# EAGLE design WTPA2_Jack_PCB (EAGLE 5.10)
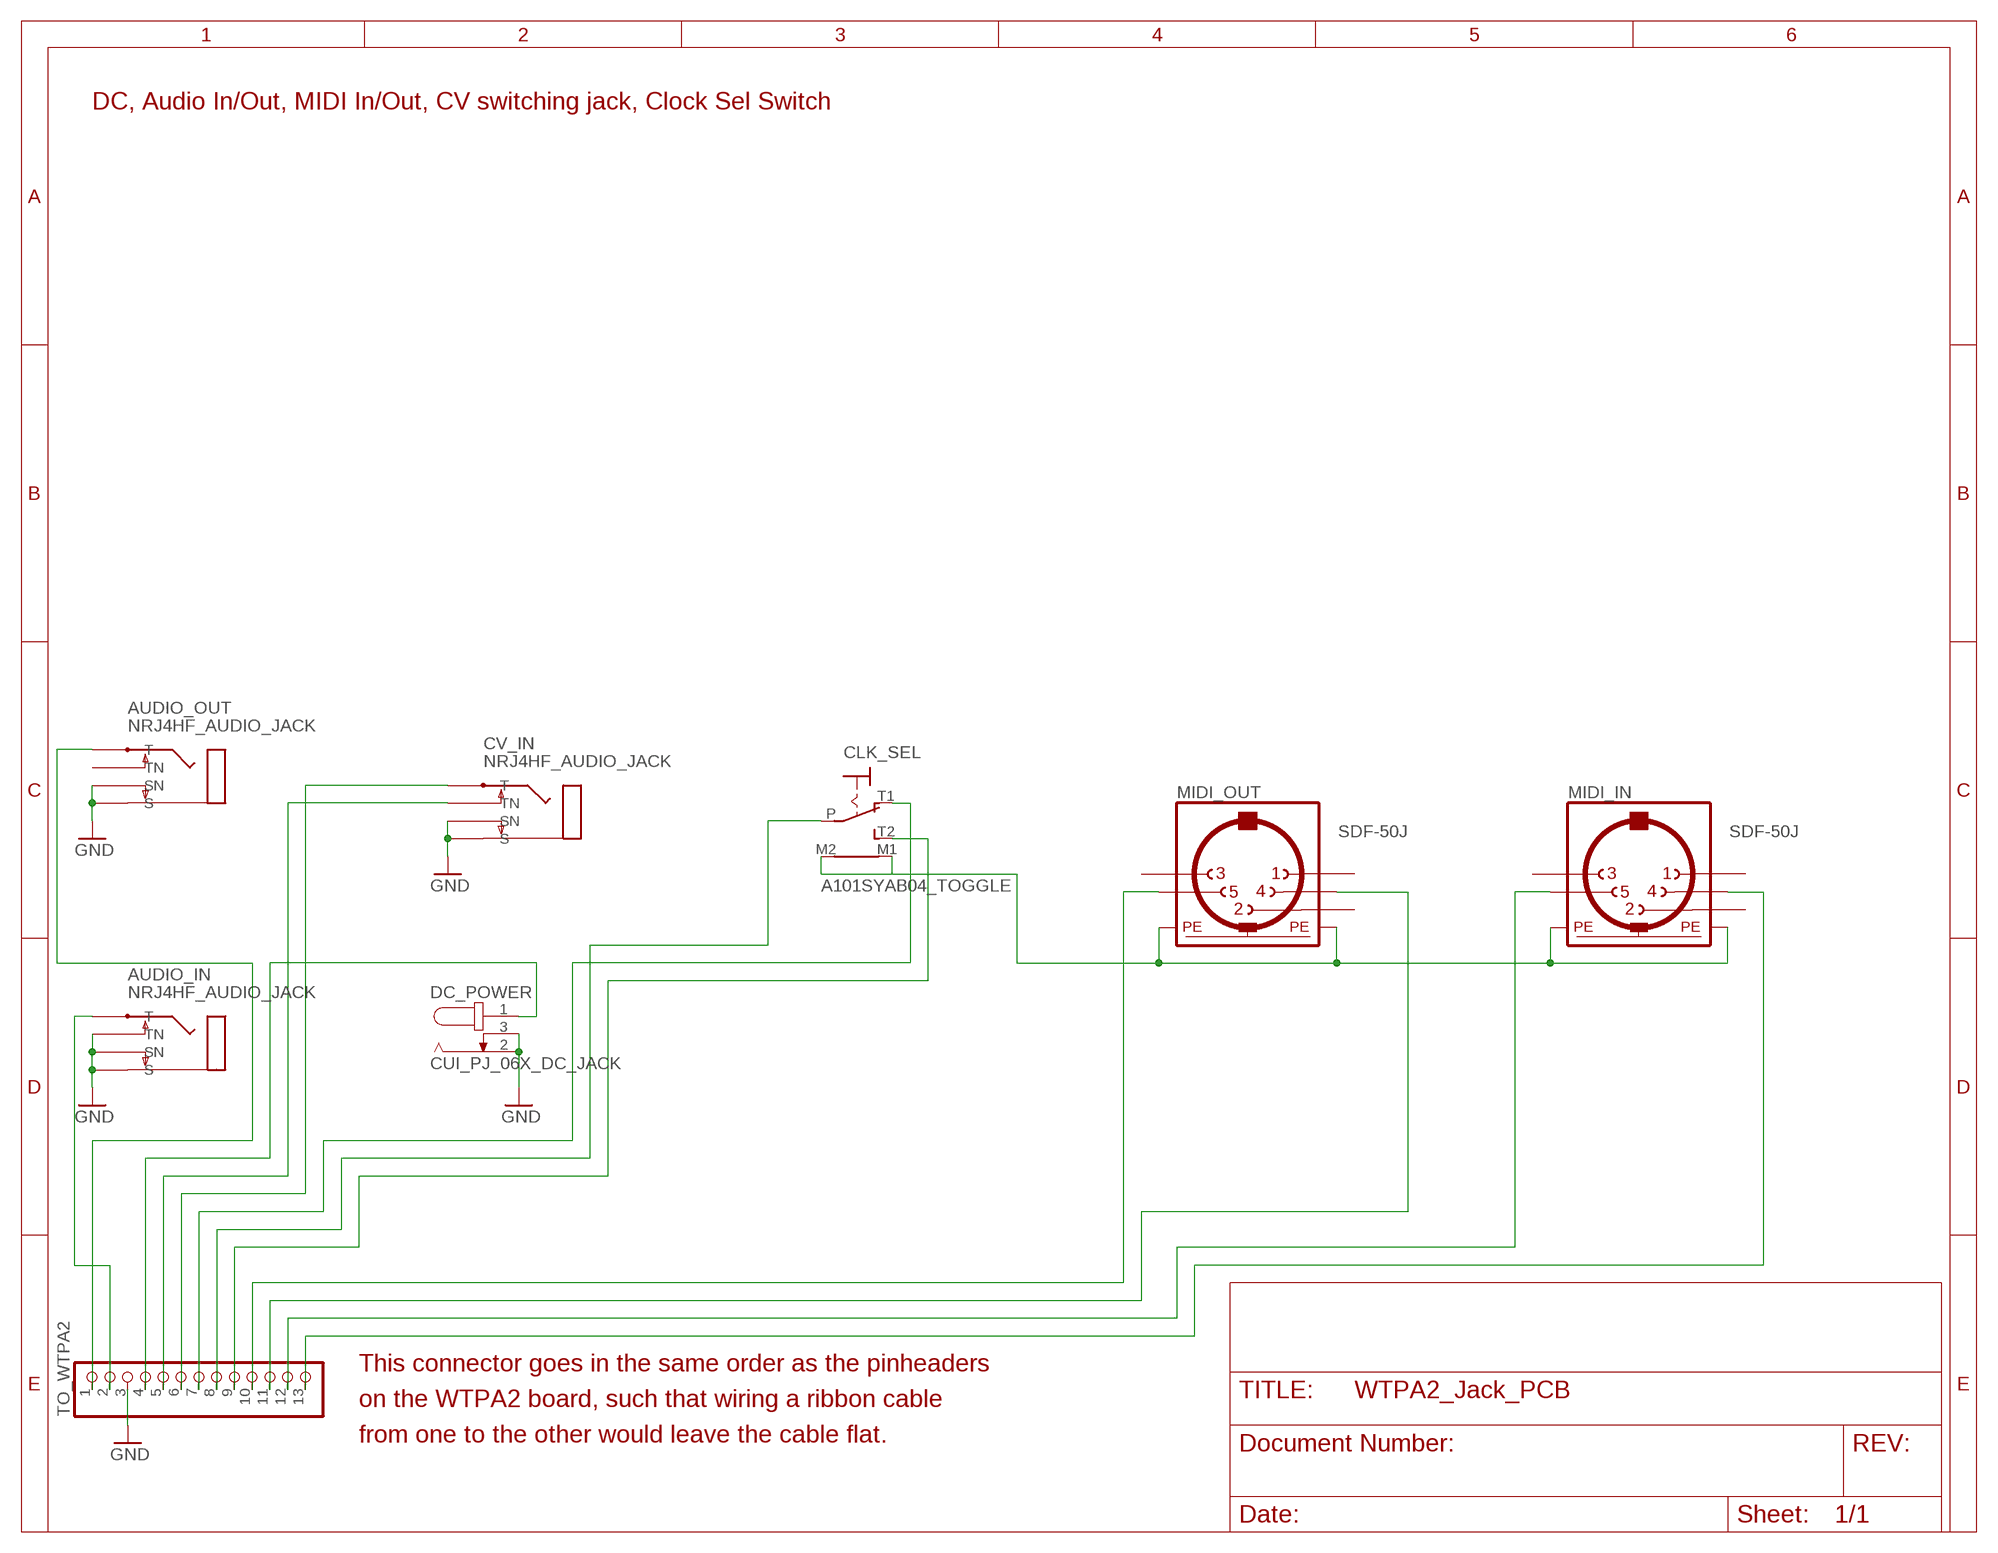
[diagram p0: schematic, sheet 1]

## Parts
AUDIO_IN  NRJ4HF_AUDIO_JACK  [NRJ4HF]
AUDIO_OUT  NRJ4HF_AUDIO_JACK  [NRJ4HF]
CLK_SEL  A101SYAB04_TOGGLE  [A101SYAB04_TOGGLE]
CV_IN  NRJ4HF_AUDIO_JACK  [NRJ4HF]
DC_POWER  CUI_PJ_06X_DC_JACK  [CUI_PJ_06XA]
MIDI_IN  SDF-50J  [SDF-50J]
MIDI_OUT  SDF-50J  [SDF-50J]
TO_WTPA2  PINHD-1X13  [1X13]

## Nets
GND: AUDIO_IN.S AUDIO_IN.SN AUDIO_IN.TN AUDIO_OUT.S AUDIO_OUT.SN CV_IN.S CV_IN.SN DC_POWER.2(SLEEVE) DC_POWER.3(SWITCH) TO_WTPA2.3
N$1: AUDIO_IN.T TO_WTPA2.2
N$2: AUDIO_OUT.T TO_WTPA2.1
N$3: DC_POWER.1(TIP) TO_WTPA2.4
N$4: CV_IN.TN TO_WTPA2.5
N$5: CV_IN.T TO_WTPA2.6
N$6: CLK_SEL.T1(O) TO_WTPA2.7
N$7: CLK_SEL.P TO_WTPA2.8
N$8: CLK_SEL.T2(S) TO_WTPA2.9
N$9: MIDI_IN.4 TO_WTPA2.13
N$10: MIDI_IN.5 TO_WTPA2.12
N$11: MIDI_OUT.4 TO_WTPA2.11
N$12: MIDI_OUT.5 TO_WTPA2.10
N$13: CLK_SEL.M1(B1) CLK_SEL.M2(B) MIDI_IN.PE MIDI_IN.PE@(PE) MIDI_OUT.PE MIDI_OUT.PE@(PE)
Unconnected: AUDIO_OUT.TN MIDI_IN.1 MIDI_IN.2 MIDI_IN.3 MIDI_OUT.1 MIDI_OUT.2 MIDI_OUT.3

## Notes on the sheet
- DC, Audio In/Out, MIDI In/Out, CV switching jack, Clock Sel Switch
- This connector goes in the same order as the pinheaders
- on the WTPA2 board, such that wiring a ribbon cable
- from one to the other would leave the cable flat.

## Library data of the parts
AUDIO_IN AUDIO_OUT CV_IN = TBParts:NRJ4HF_AUDIO_JACK: Neutrik NRJ4HF Audio Conn Mono, dual switched 1/4" (quarter inch) connector. "Normalizing" -- IE, two switches. Has two mounting holes and 4 electrical connections. Part of Neutrik "Slimline" series.
CLK_SEL = TBParts:A101SYAB04_TOGGLE: A101SYAB04 Right angle, PCB mount SPDT toggle switch with threaded bushing. 4/40 threads, 2 mount holes in PCB. Bushing projects 0.350 past mount holes, and bottom of bushing is flush with board.
DC_POWER = TBParts:CUI_PJ_06X_DC_JACK: Usable for 2.1mm x 5.5mm Right Angle DC Power Jacks with switches. This includes CUI PJ-066a and PJ-067a (the difference is a hole in the solder leg for wire attachment). The bushing on this part sticks out 5.7mm, and takes a 5/16 x 32 nut. NOTE: This footprint also fits PJ-066B and PJ-067B, which are the same thing except they accept 2.5mm x 5.5mm plugs.
MIDI_IN MIDI_OUT = TBParts:SDF-50J: 180 degree 5-pin DIN (MIDI) CONNECTOR CUI part number SDF-50j. Has two weird mounting holes in the face which I hope are for 2mm screws. We'll see.
TO_WTPA2 = pinhead:PINHD-1X13: PIN HEADER

## Board
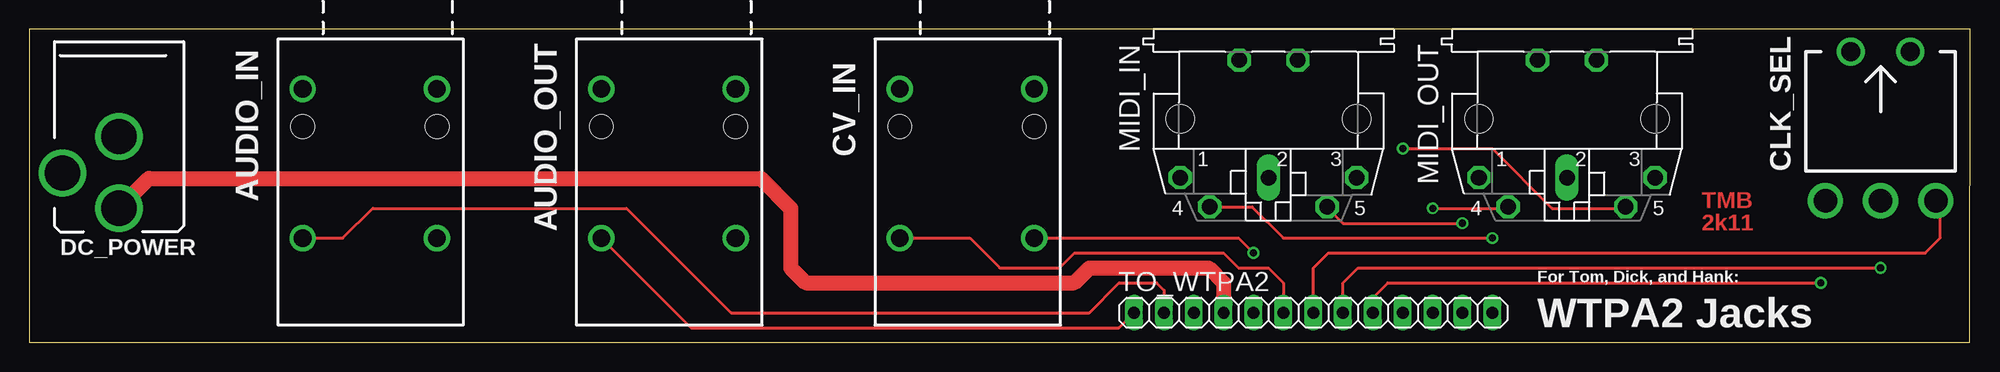
[diagram p1: board, top side]
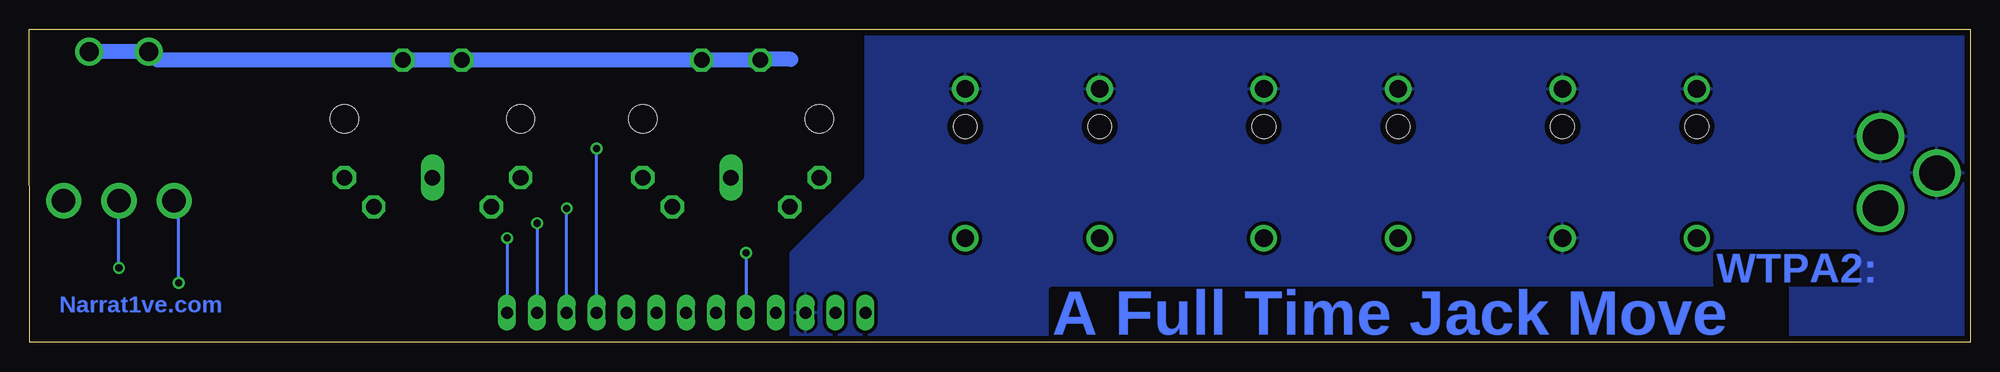
[diagram p2: board, bottom side, seen from below]

Size 165.1 x 26.67 mm. Coordinates in mm from the lower left corner, seen from the top.
Outline: 0,0 165.08,0 165.1,26.67 0,26.67 0,0
Copper layers (1*16): Top 0.035mm / dielectric 1.5mm / Bottom 0.035mm
Design rules "default *": minimum track width 8mil, minimum drill 16mil, track to track 8mil, track to pad 8mil, pad to pad 8mil, via to via 8mil, smd to smd 0mil, copper to edge 20mil, drill to drill 8mil, minimum pad ring 10mil, minimum via ring 8mil, stop-mask expansion 4mil, vias tented up to drill 0mil, thermal gap 10mil

### Footprints (pad centres in the part's own frame; a part is rotated, then mirrored left to right if it is on the bottom)
NRJ4HF = drill 1.5 round: S 0,7.23; SN 0,-4.2; T -12.7,7.23; TN -12.7,-4.2 | hole 2: -3.2,-4.2; -3.2,7.23
A101SYAB04_TOGGLE = drill 1.6 round: M1 0,-2.54; M2 0,2.54 | drill 2 round: P -12.7,0; T1 -12.7,-4.699; T2 -12.7,4.699
CUI_PJ_06XA = drill 3 round: 1 0,0; 2 0,6.1; 3 -4.8,3
SDF-50J = drill 1.321 octagon: 1 7.5,5; 3 -7.5,5; 4 5,7.5; 5 -5,7.5; PE -2.5,-5; PE@ 2.5,-5 | drill 1.321 long: 2 0,5 | hole 2.4: 7.5,0; -7.5,0
1X13 = drill 1.016 long: 1 -15.24,0; 2 -12.7,0; 3 -10.16,0; 4 -7.62,0; 5 -5.08,0; 6 -2.54,0; 7 0,0; 8 2.54,0; 9 5.08,0; 10 7.62,0; 11 10.16,0; 12 12.7,0; 13 15.24,0

### Placement (x,y rotation side)
AUDIO_IN  30.48,21.59 90 top
AUDIO_OUT  55.88,21.59 90 top
CLK_SEL  157.48,24.77 90 top
CV_IN  81.28,21.59 90 top
DC_POWER  7.62,11.43 0 top
MIDI_IN  105.41,19.05 180 top
MIDI_OUT  130.81,19.05 180 top
TO_WTPA2  109.22,2.54 0 top

### Tracks (layer width: path | path; a pad name or v marks a point on that pad's centre or on a via)
GND
  pour Bottom (isolate 0.305): 0,26.67 93.98,26.67 93.98,13.97 100.33,7.62 100.33,0 0,0
N$1
  Top 0.254: AUDIO_IN.T 26.67,8.89 29.21,11.43 50.8,11.43 59.69,2.54 90.17,2.54 92.71,5.08 95.89,5.08 96.52,4.45 TO_WTPA2.2
N$2
  Top 0.254: TO_WTPA2.1 92.71,1.27 56.27,1.27 AUDIO_OUT.T
N$3
  Top 1.27: DC_POWER.1 10.16,13.97 62.23,13.97 64.77,11.43 64.77,6.35 66.04,5.08 88.9,5.08 90.17,6.35 100.33,6.35 101.6,5.08 TO_WTPA2.4
N$4  (via drill 0.6)
  Top 0.254: CV_IN.TN 102.87,8.89 v104.14,7.62
  Bottom 0.254: v104.14,7.62 TO_WTPA2.5
N$5
  Top 0.254: CV_IN.T 80.01,8.89 82.55,6.35 87.63,6.35 88.9,7.62 101.6,7.62 102.87,6.35 105.41,6.35 106.68,5.08 TO_WTPA2.6
N$6
  Top 0.254: TO_WTPA2.7 109.22,6.35 110.49,7.62 161.29,7.62 162.56,8.89 162.56,12.32 CLK_SEL.T1
N$7  (via drill 0.6)
  Top 0.254: TO_WTPA2.8 111.76,5.08 113.03,6.35 v157.48,6.35
  Bottom 0.254: v157.48,6.35 CLK_SEL.P
N$8  (via drill 0.6)
  Top 0.254: TO_WTPA2.9 114.3,3.81 115.57,5.08 v152.4,5.08
  Bottom 0.254: v152.4,5.08 152.4,12.32 CLK_SEL.T2
N$9  (via drill 0.6)
  Top 0.254: MIDI_IN.4 104.02,11.55 106.68,8.89 v124.46,8.89
  Bottom 0.254: v124.46,8.89 TO_WTPA2.13
N$10  (via drill 0.6)
  Top 0.254: MIDI_IN.5 110.41,11.51 111.76,10.16 v121.92,10.16
  Bottom 0.254: v121.92,10.16 TO_WTPA2.12
N$11  (via drill 0.6)
  Top 0.254: v119.38,11.43 125.69,11.43 MIDI_OUT.4
  Bottom 0.254: TO_WTPA2.11 v119.38,11.43
N$12  (via drill 0.6)
  Top 0.254: v116.84,16.51 124.46,16.51 129.54,11.43 135.69,11.43 MIDI_OUT.5
  Bottom 0.254: TO_WTPA2.10 v116.84,16.51
N$13
  Bottom 1.27: CLK_SEL.M1 CLK_SEL.M2 154.22,24.05 MIDI_OUT.PE MIDI_OUT.PE@ MIDI_IN.PE MIDI_IN.PE@ 102.83,24.13 100.33,24.13

### Text on the board
Top: TMB | 2k11
Bottom: WTPA2: | Narrat1ve.com | A Full Time Jack Move
tPlace: For Tom, Dick, and Hank: | WTPA2 Jacks